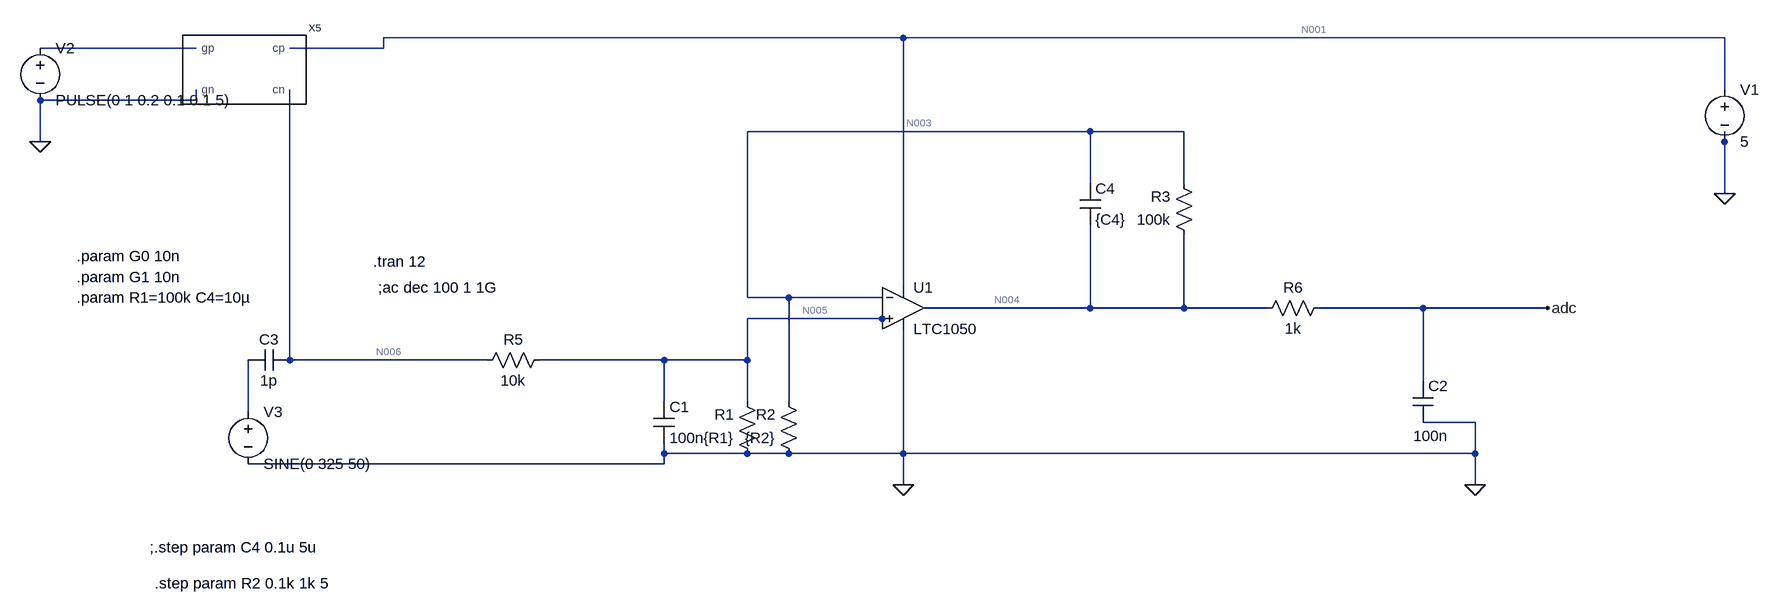
[diagram p0: schematic Schéma.asc]
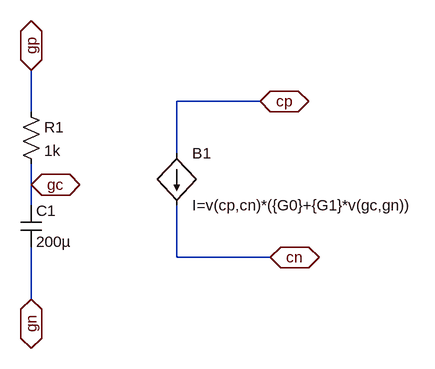
[diagram p1: sub-circuit capteur_graphite.asc]
Schéma.asc, the LTspice schematic file:
Version 4
SHEET 1 1864 680
WIRE 272 -688 -528 -688
WIRE 1536 -688 272 -688
WIRE -816 -672 -1056 -672
WIRE -528 -672 -528 -688
WIRE -528 -672 -672 -672
WIRE 1536 -608 1536 -688
WIRE -816 -592 -816 -608
WIRE -816 -592 -1056 -592
WIRE 560 -544 32 -544
WIRE 704 -544 560 -544
WIRE -1056 -528 -1056 -592
WIRE 1536 -528 1536 -544
WIRE 560 -464 560 -544
WIRE 704 -464 704 -544
WIRE 1536 -448 1536 -528
WIRE 272 -304 272 -688
WIRE 32 -288 32 -544
WIRE 96 -288 32 -288
WIRE 240 -288 96 -288
WIRE 560 -272 560 -400
WIRE 560 -272 304 -272
WIRE 704 -272 704 -384
WIRE 704 -272 560 -272
WIRE 832 -272 704 -272
WIRE 1072 -272 912 -272
WIRE 1264 -272 1072 -272
WIRE 240 -256 32 -256
WIRE 256 -256 240 -256
WIRE -672 -192 -672 -608
WIRE -368 -192 -672 -192
WIRE -96 -192 -288 -192
WIRE 32 -192 32 -256
WIRE 32 -192 -96 -192
WIRE 1072 -160 1072 -272
WIRE -96 -128 -96 -192
WIRE 32 -128 32 -192
WIRE 96 -128 96 -288
WIRE -736 -112 -736 -192
WIRE 1152 -96 1072 -96
WIRE -96 -48 -96 -64
WIRE 32 -48 -96 -48
WIRE 96 -48 32 -48
WIRE 272 -48 272 -240
WIRE 272 -48 96 -48
WIRE 1152 -48 1152 -96
WIRE 1152 -48 272 -48
WIRE -96 -32 -96 -48
WIRE -96 -32 -736 -32
WIRE 272 0 272 -48
WIRE 1152 0 1152 -48
FLAG 1536 -448 0
FLAG 1152 0 0
FLAG 272 0 0
FLAG 1264 -272 adc
FLAG -1056 -528 0
SYMBOL res -272 -208 R90
WINDOW 0 0 56 VBottom 2
WINDOW 3 32 56 VTop 2
SYMATTR InstName R5
SYMATTR Value 10k
SYMBOL res 48 -32 R180
WINDOW 0 36 76 Left 2
WINDOW 3 36 40 Left 2
SYMATTR InstName R1
SYMATTR Value {R1}
SYMBOL res 112 -32 R180
WINDOW 0 36 76 Left 2
WINDOW 3 36 40 Left 2
SYMATTR InstName R2
SYMATTR Value {R2}
SYMBOL res 720 -368 R180
WINDOW 0 36 76 Left 2
WINDOW 3 36 40 Left 2
SYMATTR InstName R3
SYMATTR Value 100k
SYMBOL res 816 -256 R270
WINDOW 0 32 56 VTop 2
WINDOW 3 0 56 VBottom 2
SYMATTR InstName R6
SYMATTR Value 1k
SYMBOL cap -112 -128 R0
SYMATTR InstName C1
SYMATTR Value 100n
SYMBOL cap 544 -464 R0
SYMATTR InstName C4
SYMATTR Value {C4}
SYMBOL cap 1056 -160 R0
WINDOW 3 1 85 Left 2
SYMATTR Value 100n
SYMATTR InstName C2
SYMBOL OpAmps\\LTC1050 272 -336 R0
SYMATTR InstName U1
SYMBOL voltage 1536 -624 R0
WINDOW 123 0 0 Left 0
WINDOW 39 0 0 Left 0
SYMATTR InstName V1
SYMATTR Value 5
SYMBOL Capteur_graphite -736 -640 R0
SYMATTR InstName X5
SYMBOL cap -672 -208 R90
WINDOW 0 0 32 VBottom 2
WINDOW 3 32 32 VTop 2
SYMATTR InstName C3
SYMATTR Value 1p
SYMBOL voltage -1056 -688 R0
WINDOW 123 0 0 Left 0
WINDOW 39 0 0 Left 0
SYMATTR InstName V2
SYMATTR Value PULSE(0 1 0.2 0.1 0.1 5)
SYMBOL voltage -736 -128 R0
SYMATTR InstName V3
SYMATTR Value SINE(0 325 50)
TEXT -544 -344 Left 2 !.tran 12
TEXT -536 -304 Left 2 !;ac dec 100 1 1G
TEXT -1000 -352 Left 2 !.param G0 10n
TEXT -1000 -320 Left 2 !.param G1 10n
TEXT -1000 -288 Left 2 !.param R1=100k C4=10µ
TEXT -888 96 Left 2 !;.step param C4 0.1u 5u
TEXT -880 152 Left 2 !.step param R2 0.1k 1k 5

capteur_graphite.asc, the sub-circuit schematic file:
Version 4
SHEET 1 2808 19324
WIRE 496 80 368 80
WIRE 144 96 144 32
WIRE 368 160 368 80
WIRE 144 208 144 176
WIRE 144 240 144 208
WIRE 368 320 368 240
WIRE 512 320 368 320
WIRE 144 384 144 304
FLAG 144 32 gp
IOPIN 144 32 BiDir
FLAG 144 384 gn
IOPIN 144 384 BiDir
FLAG 144 208 gc
IOPIN 144 208 BiDir
FLAG 496 80 cp
IOPIN 496 80 BiDir
FLAG 512 320 cn
IOPIN 512 320 BiDir
SYMBOL res 128 80 R0
SYMATTR InstName R1
SYMATTR Value 1k
SYMBOL cap 128 240 R0
SYMATTR InstName C1
SYMATTR Value 200µ
SYMBOL bi 368 160 R0
SYMATTR InstName B1
SYMATTR Value I=v(cp,cn)*({G0}+{G1}*v(gc,gn))

The netlist it stands for:
* Schéma.asc
R5 N005 N006 10k
R1 0 N005 {R1}
R2 0 N003 {R2}
R3 N004 N003 100k
R6 N004 adc 1k
C1 N005 0 100n
C4 N003 N004 {C4}
C2 adc 0 100n
XU1 N005 N003 N001 0 N004 LTC1050  ; pins In+ In- V+ V- OUT
V1 N001 0 5
XX5 N001 N006 N002 0 capteur_graphite
C3 N006 N007 1p
V2 N002 0 PULSE(0 1 0.2 0.1 0.1 5)
V3 N007 0 SINE(0 325 50)

* block symbol definitions
.subckt capteur_graphite cp cn gp gn
R1 gp gc 1k
C1 gc gn 200µ
B1 cp cn I=v(cp,cn)*({G0}+{G1}*v(gc,gn))
.ends capteur_graphite

.tran 12
;ac dec 100 1 1G
.param G0 10n
.param G1 10n
.param R1=100k C4=10µ
;.step param C4 0.1u 5u
.step param R2 0.1k 1k 5
.lib LTC.lib
.backanno
.end

* Results of the author's LTspice run, read from the files saved beside the schematic
* Operating Point (first step), zero values left out:
*   r2 = 100 
*   V(n005) = 4.995 mV
*   V(n006) = 5.494 mV
*   V(n003) = 4.747 mV
*   V(n004) = 4.752 V
*   V(adc) = 4.752 V
*   V(n001) = 5 V
*   I(R5) = -49.95 nA
*   I(R1) = -49.95 nA
*   I(R2) = -47.47 µA
*   I(R3) = 47.47 µA
*   I(V1) = -776 µA
*   Ix(u1:3) = 776 µA
*   Ix(u1:4) = -728.5 µA
*   Ix(u1:5) = -47.47 µA
*   Ix(x5:CP) = 49.95 nA
*   Ix(x5:CN) = -49.95 nA